# EAGLE design OSO-MISC-20-016 Blinky Board for Ring (EAGLE 9.6.2)
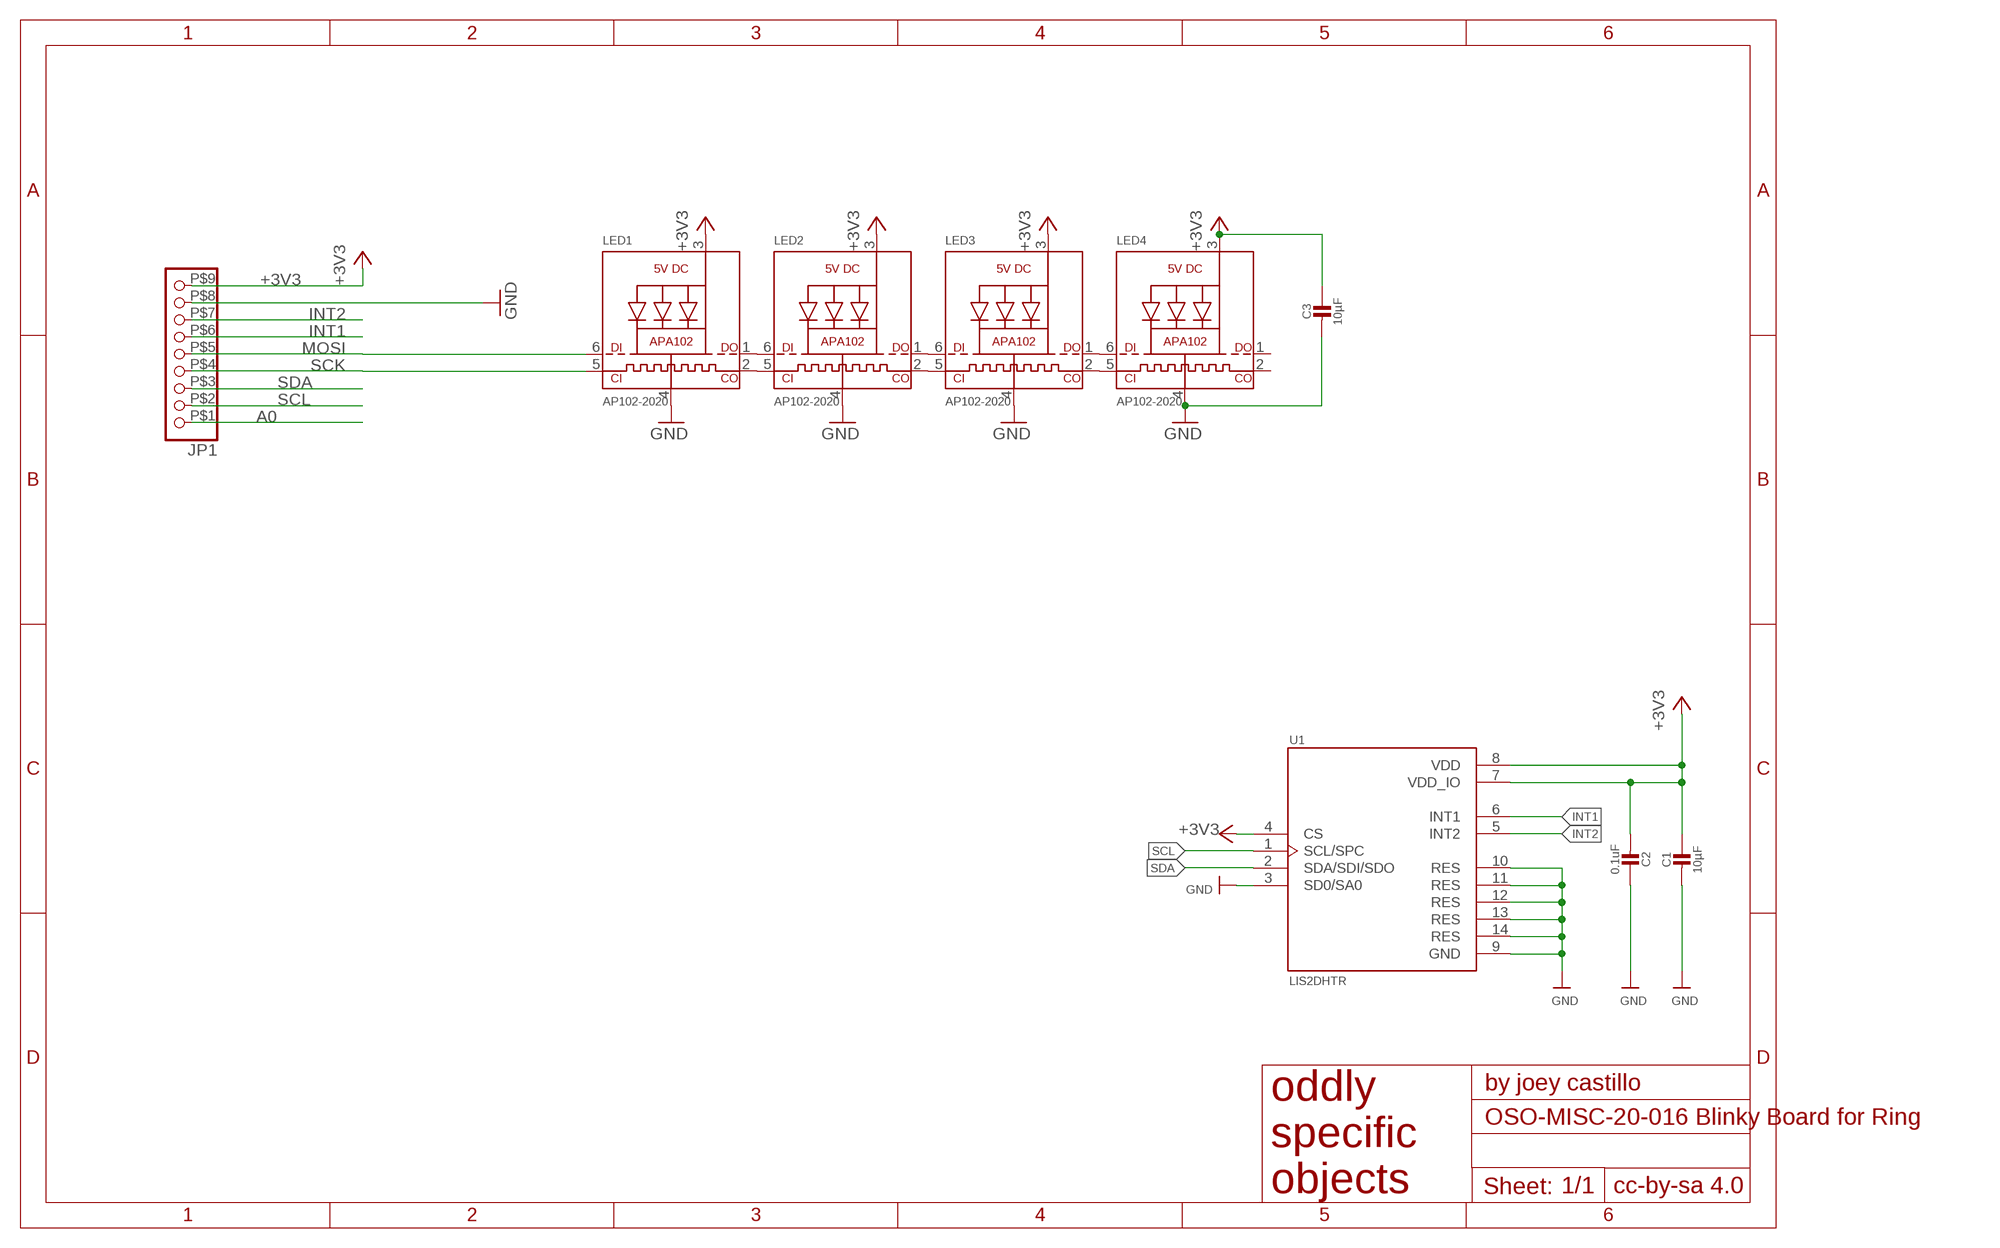
[diagram p0: schematic, sheet 1]

## Parts
C1  10µF  CAP_CERAMIC0805-NOOUTLINE  [0805-NO]
C2  0.1uF  CAP_CERAMIC0805-NOOUTLINE  [0805-NO]
C3  10µF  CAP_CERAMIC0805-NOOUTLINE  [0805-NO]
JP1  HEADER-1X9BOARD_TO_FLEX  [9PIN_SMT_CONNECTOR]
LED1  AP102-2020  APA1022020  [APA102_2020]
LED2  AP102-2020  APA1022020  [APA102_2020]
LED3  AP102-2020  APA1022020  [APA102_2020]
LED4  AP102-2020  APA1022020  [APA102_2020]
U1  LIS2DHTR  [PQFN35P200X200X100-14N]

## Nets
+3V3: C1.1 C2.2 C3.1 JP1.P$9 LED1.3(VDD) LED2.3(VDD) LED3.3(VDD) LED4.3(VDD) U1.4(CS) U1.7(VDD_IO) U1.8(VDD)
A0: JP1.P$1
GND: C1.2 C2.1 C3.2 JP1.P$8 LED1.4(GND) LED2.4(GND) LED3.4(GND) LED4.4(GND) U1.3(SD0/SA0) U1.9(GND) U1.10(RES) U1.11(RES) U1.12(RES) U1.13(RES) U1.14(RES)
INT1: JP1.P$6 U1.6(INT1)
INT2: JP1.P$7 U1.5(INT2)
MOSI: JP1.P$5 LED1.6(DI)
N$1: LED1.1(DO) LED2.6(DI)
N$2: LED1.2(CKO) LED2.5(CKI)
N$3: LED2.1(DO) LED3.6(DI)
N$4: LED2.2(CKO) LED3.5(CKI)
N$5: LED3.1(DO) LED4.6(DI)
N$6: LED3.2(CKO) LED4.5(CKI)
SCK: JP1.P$4 LED1.5(CKI)
SCL: JP1.P$2 U1.1(SCL/SPC)
SDA: JP1.P$3 U1.2(SDA/SDI/SDO)
Unconnected: LED4.1(DO) LED4.2(CKO)

## Library data of the parts
C1-C3 = microbuilder:CAP_CERAMIC: Ceramic Capacitors For new designs, use the packages preceded by an '_' character since they are more reliable: The following footprints should be used on most boards: _0402 - Standard footprint for regular board layouts _0603 - Standard footprint for regular board layouts _0805 - Standard footprint for regular board layouts _1206 - Standard footprint for regular board layouts For extremely tight-pitch boards where space is at a premium, the following 'micro-pitch' footprints can be used (smaller pads, no silkscreen outline, etc.): _0402MP - Micro-pitch footprint for very dense/compact boards _0603MP - Micro-pitch footprint for very dense/compact boards _0805MP - Micro-pitch footprint for very dense/compact boards _1206MP - Micro-pitch footprint for very dense/compact boards
JP1 = My Stuff:HEADER-1X9: PIN HEADER
LED1-LED4 = microbuilder:APA102: APA102/DotStar Pixels VCC: 5V DC Refresh Rate: 400Hz
U1 = LIS2DHTR:LIS2DHTR: MEMS digital output motion sensor: ultra low-power high performance 3-axes femto accelerometer; DESCRIPTION: Accelerometer X, Y, Z Axis ±2g, 4g, 8g, 16g 0.5Hz ~ 672Hz 14-LGA _2x2_; DIGI-KEY_PART_NUMBER: 497-13795-1-ND; DIGI-KEY_PURCHASE_URL: https://www.digikey.com/product-detail/en/stmicroelectronics/LIS2DHTR/497-13795-1-ND/4209308?utm_source=snapeda&utm_medium=aggregator&utm_campaign=symbol; MF: STMicroelectronics; MP: LIS2DHTR; PACKAGE: LGA-14 STMicroelectronics

## Net classes
1 power: width 0.305 mm

## Board
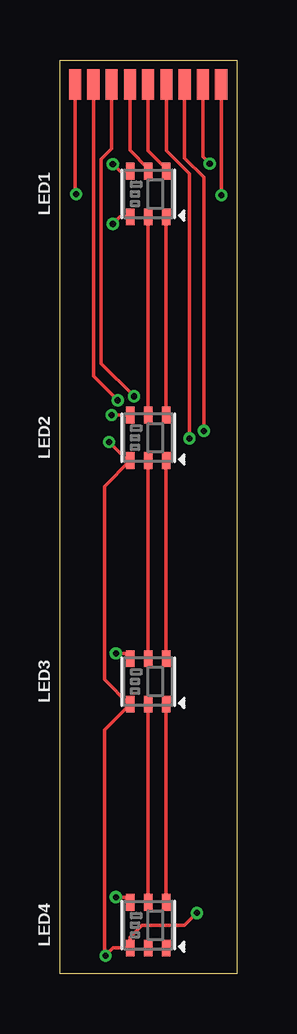
[diagram p1: board, top side]
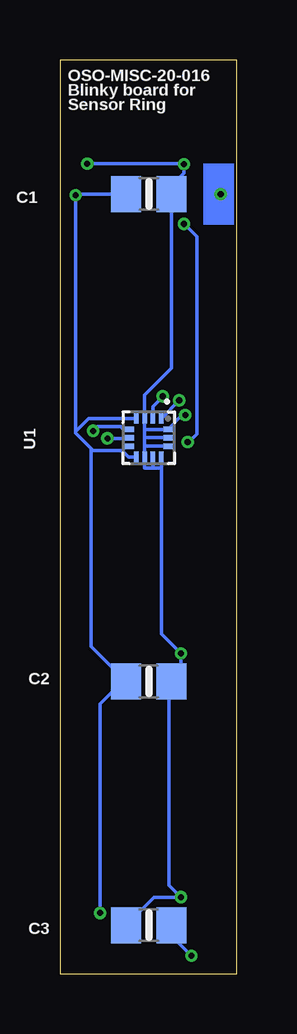
[diagram p2: board, bottom side, seen from below]

Size 7.39 x 38.1 mm. Coordinates in mm from the lower left corner, seen from the top.
Outline: 7.39,38.1 7.39,0 0,0 0,38.1 7.39,38.1
Copper layers (1*16): Top 0.035559375mm / dielectric 1.6mm / Bottom 0.035559375mm
Design rules "oshpark-2layer *": minimum track width 6mil, minimum drill 10mil, track to track 6mil, track to pad 6mil, pad to pad 6mil, via to via 6mil, smd to smd 6mil, copper to edge 15mil, drill to drill 6mil, minimum pad ring 5mil, minimum via ring 5mil, stop-mask expansion 2.5mil, vias tented up to drill 12mil, thermal gap 10mil

### Footprints (pad centres in the part's own frame; a part is rotated, then mirrored left to right if it is on the bottom)
0805-NO = smd 1.24 x 1.5: 1 -0.95,0; 2 0.95,0
9PIN_SMT_CONNECTOR = smd 0.508 x 1.27: P$1 -3.048,0; P$2 -2.286,0; P$3 -1.524,0; P$4 -0.762,0; P$5 0,0; P$6 0.762,0; P$7 1.524,0; P$8 2.286,0; P$9 3.048,0
APA102_2020 = smd 0.7 x 0.35: 1 -0.95,-0.75; 2 -0.95,0; 3 -0.95,0.75; 4 0.95,0.75; 5 0.95,0; 6 0.95,-0.75
PQFN35P200X200X100-14N = smd 0.39 x 0.2: 1 -0.795,0.525; 2 -0.795,0.175; 3 -0.795,-0.175; 4 -0.795,-0.525; 8 0.795,-0.525; 9 0.795,-0.175; 10 0.795,0.175; 11 0.795,0.525 | smd 0.2 x 0.39: 5 -0.35,-0.795; 6 0,-0.795; 7 0.35,-0.795; 12 0.35,0.795; 13 0,0.795; 14 -0.35,0.795

### Placement (x,y rotation side)
C1  3.68,32.51 0 bottom
C2  3.68,12.19 180 bottom
C3  3.68,2.03 180 bottom
JP1  3.68,37.08 0 top
LED1  3.68,32.51 90 top
LED2  3.68,22.35 90 top
LED3  3.68,12.19 90 top
LED4  3.68,2.03 90 top
U1  3.68,22.35 270 bottom

### Tracks (layer width: path | path; a pad name or v marks a point on that pad's centre or on a via)
+3V3  (via drill 0.25)
  Top 0.152: JP1.P$9 v6.73,32.47 v6.74,32.47 | v5.71,2.54 5.21,2.03 3.43,2.03 2.93,1.54 LED4.3 2.22,1.08 v1.9,0.76 1.85,0.81 1.85,10.16 LED3.3 2.88,11.24 1.85,12.27 1.85,20.32 LED2.3 2.83,21.4 v2.06,22.17 | LED1.3 2.5,31.56 v2.21,31.27
  Bottom 0.152: 4.79,21.82 6.01,21.82 6.1,21.91 | 4.79,21.82 4.52,21.56 U1.8 | U1.4 6.19,23.15 6.74,22.6 | v5.71,2.54 5.71,11.26 4.79,12.19 C2.2 6.1,13.66 6.1,21.91 | v2.21,31.27 1.68,30.73 1.68,22.5 2.01,22.17 v2.06,22.17 | C3.1 2.73,1.59 v1.9,0.76 | U1.7 4.61,22 4.79,21.82 | C1.1 6.74,32.51 v6.74,32.47 6.74,22.6 | 6.1,21.91 6.74,22.55 6.74,22.6
A0  (via drill 0.25)
  Top 0.152: JP1.P$1 0.63,32.56 v0.68,32.51
GND  (via drill 0.25)
  Top 0.152: v6.25,33.78 5.97,34.06 JP1.P$8 | LED1.4 2.5,33.46 v2.21,33.76 | LED2.4 v2.16,23.29 | v2.34,13.36 2.71,13.36 LED3.4 | v2.34,3.2 2.71,3.2 LED4.4
  Bottom 0.152: 3.51,21.08 3.16,21.08 | U1.10 3.51,21.08 | U1.11 3.16,21.08 | 3.86,22.7 U1.3 3.86,24.13 2.73,25.26 C1.2 2.73,32.87 2.21,33.39 v2.21,33.76 2.23,33.78 v6.25,33.78 | 3.86,22 U1.9 3.86,21.08 3.51,21.08 | U1.13 3.86,22.35 | 3.86,22.7 U1.14 2.3,23.29 v2.16,23.29 | U1.12 3.86,22 | 3.86,22.7 3.86,22.35 | 3.86,22 3.86,22.35 | C3.2 3.46,3.2 v2.34,3.2 2.83,3.7 2.83,12.09 C2.1 2.34,12.59 v2.34,13.36 3.16,14.18 3.16,21.08
INT1  (via drill 0.25)
  Top 0.152: JP1.P$6 4.45,34.31 5.41,33.35 v5.41,22.33
  Bottom 0.152: U1.6 4.5,22.33 v5.41,22.33
INT2  (via drill 0.25)
  Top 0.152: JP1.P$7 5.21,34.01 6.01,33.2 v6.01,22.64
  Bottom 0.152: v6.01,22.64 5.82,22.83 4.86,22.83 4.73,22.7 U1.5
MOSI
  Top 0.152: JP1.P$5 3.68,34.33 4.43,33.58 LED1.6
N$1
  Top 0.152: LED1.1 LED2.6
N$2
  Top 0.152: LED1.2 LED2.5
N$3
  Top 0.152: LED2.1 LED3.6
N$4
  Top 0.152: LED3.5 LED2.2
N$5
  Top 0.152: LED4.6 LED3.1
N$6
  Top 0.152: LED3.2 LED4.5
SCK
  Top 0.152: JP1.P$4 2.92,34.33 3.68,33.57 LED1.5
SCL  (via drill 0.25)
  Top 0.152: v2.41,23.91 1.4,24.93 JP1.P$2
  Bottom 0.152: U1.1 2.41,23.89 v2.41,23.91
SDA  (via drill 0.25)
  Top 0.152: JP1.P$3 2.16,34.39 1.73,33.96 1.73,25.45 v3.1,24.08
  Bottom 0.152: v3.1,24.08 3.1,24.06 3.51,23.65 U1.2
(copper drawn outside any net)
  shapes: Bottom area x1

### Text on the board
bPlace: OSO-MISC-20-016 / Blinky board for / Sensor Ring